# EAGLE design bpanel_09 (EAGLE 5.00)
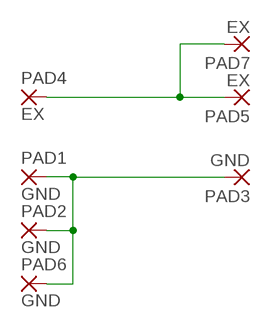
[diagram p0: schematic, sheet 1]

## Parts
PAD1  GND  SMD5  [SMD2,54-5,08]
PAD2  GND  SMD5  [SMD2,54-5,08]
PAD3  GND  SMD5  [SMD2,54-5,08]
PAD4  EX  SMD5  [SMD2,54-5,08]
PAD5  EX  SMD5  [SMD2,54-5,08]
PAD6  GND  SMD5  [SMD2,54-5,08]
PAD7  EX  SMD5  [SMD2,54-5,08]

## Nets
EX: PAD4.1(P) PAD5.1(P) PAD7.1(P)
GND: PAD1.1(P) PAD2.1(P) PAD3.1(P) PAD6.1(P)

## Library data of the parts
PAD1-PAD7 = wirepad:SMD5: SMD PAD

## Net classes
1 1: width 2.032 mm
2 2: width 0.508 mm

## Board
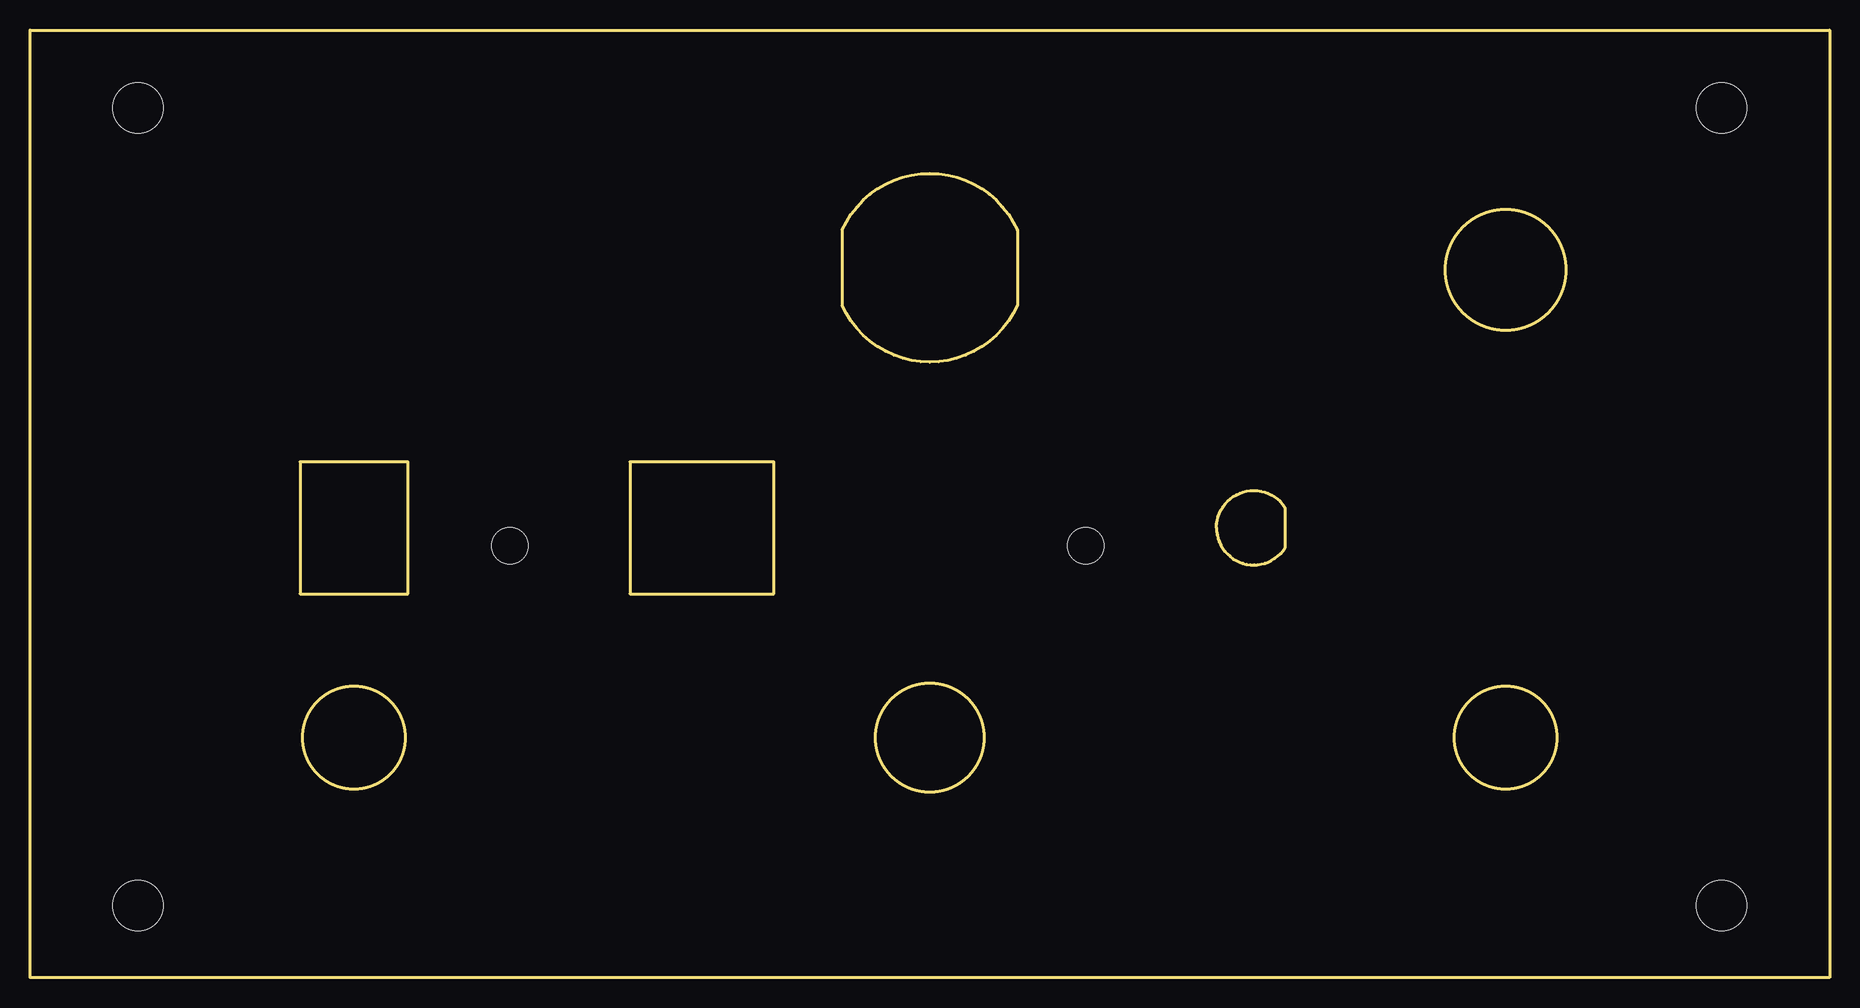
[diagram p1: board, top side]
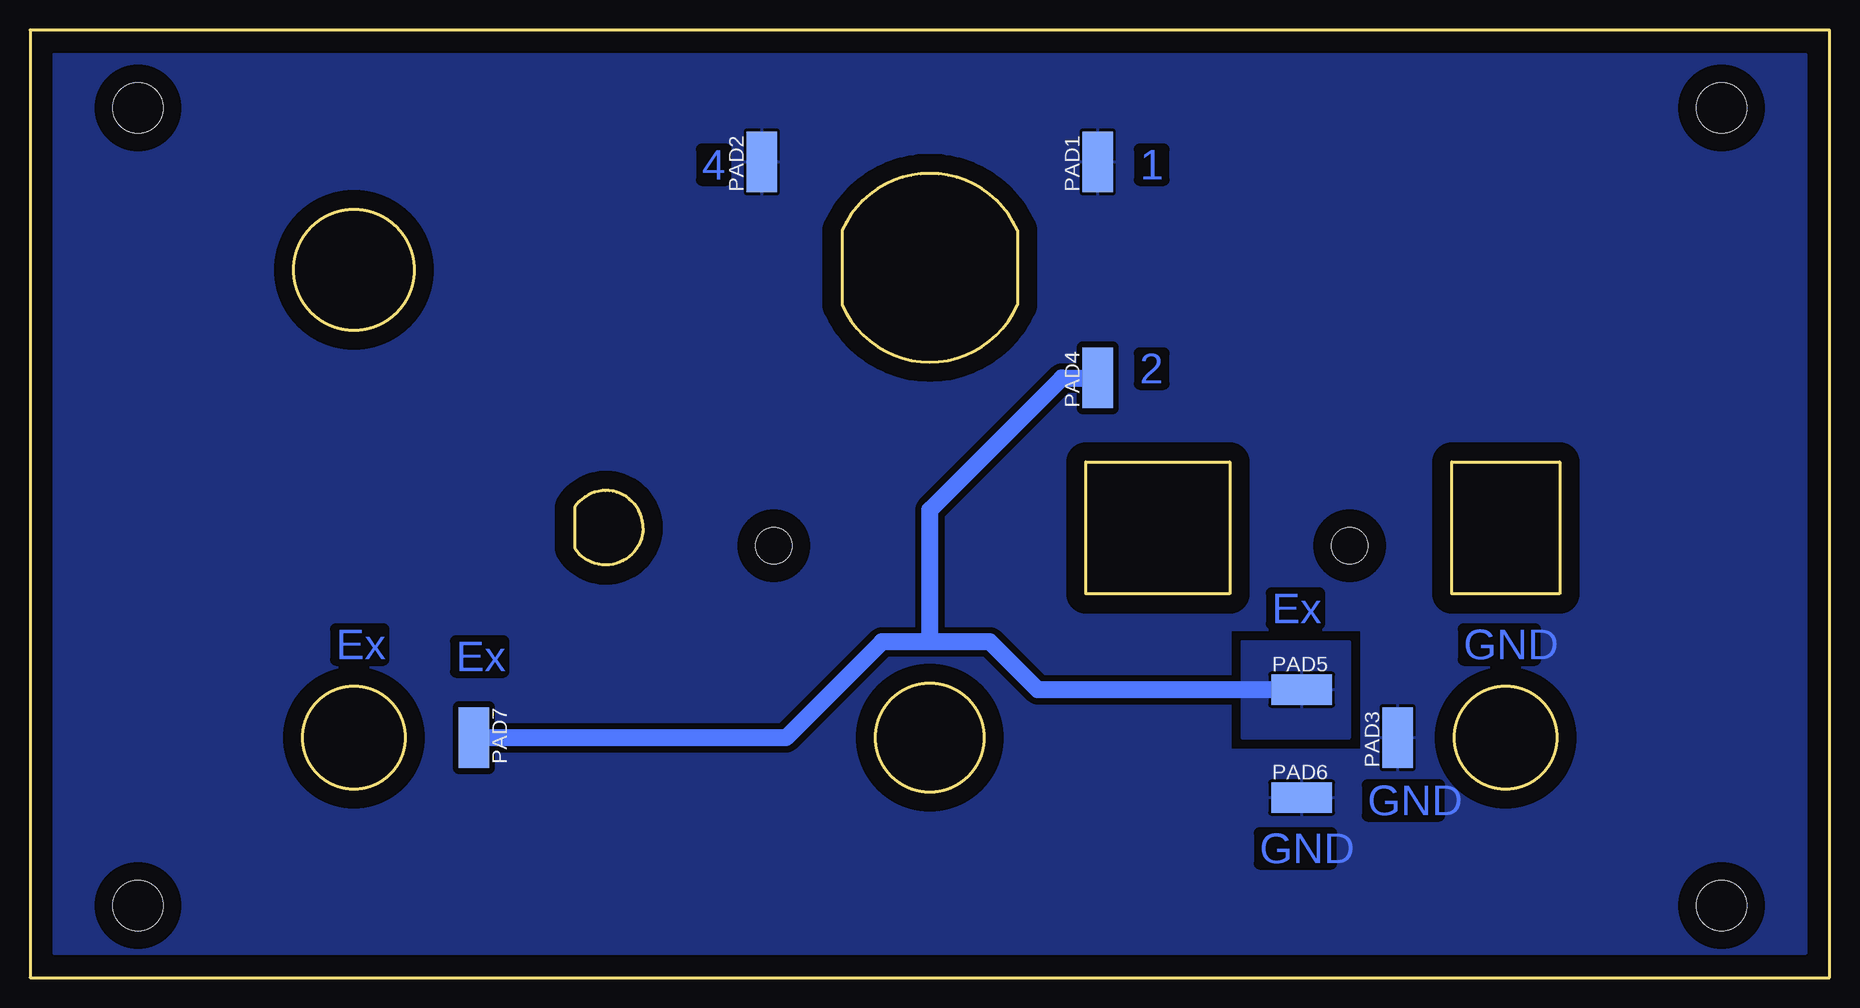
[diagram p2: board, bottom side, seen from below]

Size 150 x 79 mm. Coordinates in mm from the lower left corner, seen from the top.
Outline: 0,0 0,79 150,79 150,0 0,0
Outline: 67.7,62.3 arc-132 82.3,62.3 82.3,56.05 arc-132 67.7,56.05 67.7,62.3
Outline: 22.5,32 31.5,32 31.5,43 22.5,43 22.5,32
Outline: 50,32 62,32 62,43 50,43 50,32
Outline: 104.6,39.2 104.6,35.8 arc-147 98.9,37.5 arc-147 104.6,39.2
Outline: circle at 27,20 radius 4.25
Outline: circle at 123,20 radius 4.25
Outline: circle at 75,20 radius 4.5
Outline: circle at 123,59 radius 5
Copper layers (1*16): Top 0.035mm / dielectric 1.5mm / Bottom 0.035mm
Design rules "default *": minimum track width 10mil, minimum drill 24mil, track to track 20mil, track to pad 20mil, pad to pad 20mil, via to via 20mil, smd to smd 40mil, copper to edge 60mil, drill to drill 20mil, minimum pad ring 10mil, minimum via ring 8mil, stop-mask expansion 4mil, vias tented up to drill 0mil, thermal gap 10mil
Holes 4.2 mm at 9,72.5 141,72.5 141,6 9,6
Holes 3 mm at 40,36 88,36

### Footprints (pad centres in the part's own frame; a part is rotated, then mirrored left to right if it is on the bottom)
SMD2,54-5,08 = smd 2.54 x 5.08: 1 0,0

### Placement (x,y rotation side)
PAD1  61,68 0 bottom
PAD2  89,68 0 bottom
PAD3  36,20 0 bottom
PAD4  61,50 0 bottom
PAD5  44,24 270 bottom
PAD6  44,15 270 bottom
PAD7  113,20 180 bottom

### Tracks (layer width: path | path; a pad name or v marks a point on that pad's centre or on a via)
EX
  Bottom 1.422: PAD4.1 64,50 75,39 75,28 | 75,28 79,28 87,20 PAD7.1 | PAD5.1 66,24 70,28 75,28
  pour Bottom: 40,28 49,28 49,20 40,20
GND
  pour Bottom: 2,2 39,2 39,29 50,29 50,2 148,2 148,77 2,77
  pour Bottom: 51,2 51,19 38,19 38,2

### Text on the board
Bottom: 1 | 4 | 2 | Ex | GND | Ex | Ex | GND | GND